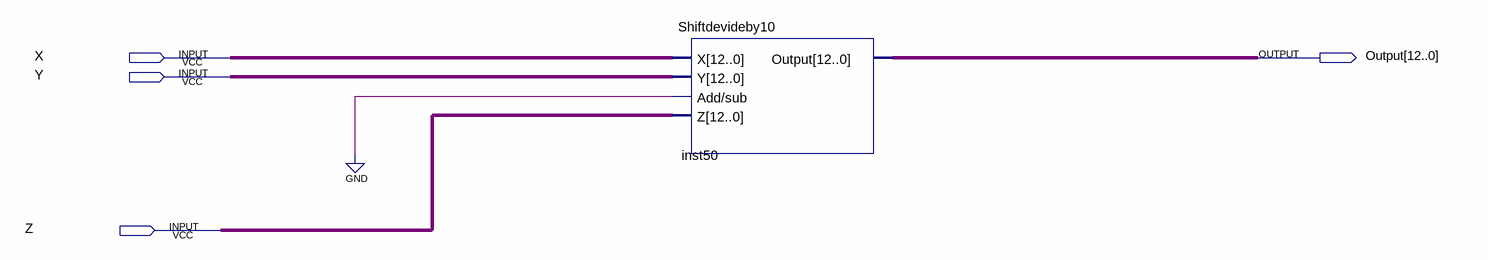
[diagram p0: schematic sheet]
// Quartus schematic DivisionTest.bdf as structural Verilog: 1 symbols, 4 pins
module DivisionTest (
  input  X,
  input  Y,
  input  Z,
  output [12:0] Output
);

  wire [12:0] undriven, undriven_2, undriven_3;

  Shiftdevideby10 inst50 (.X(undriven_3), .Y(undriven), .\Add/sub (1'b0), .Z(undriven_2), .Output(Output));
endmodule
